# EAGLE design UknownWatch_Bottom (EAGLE 9.6.2)
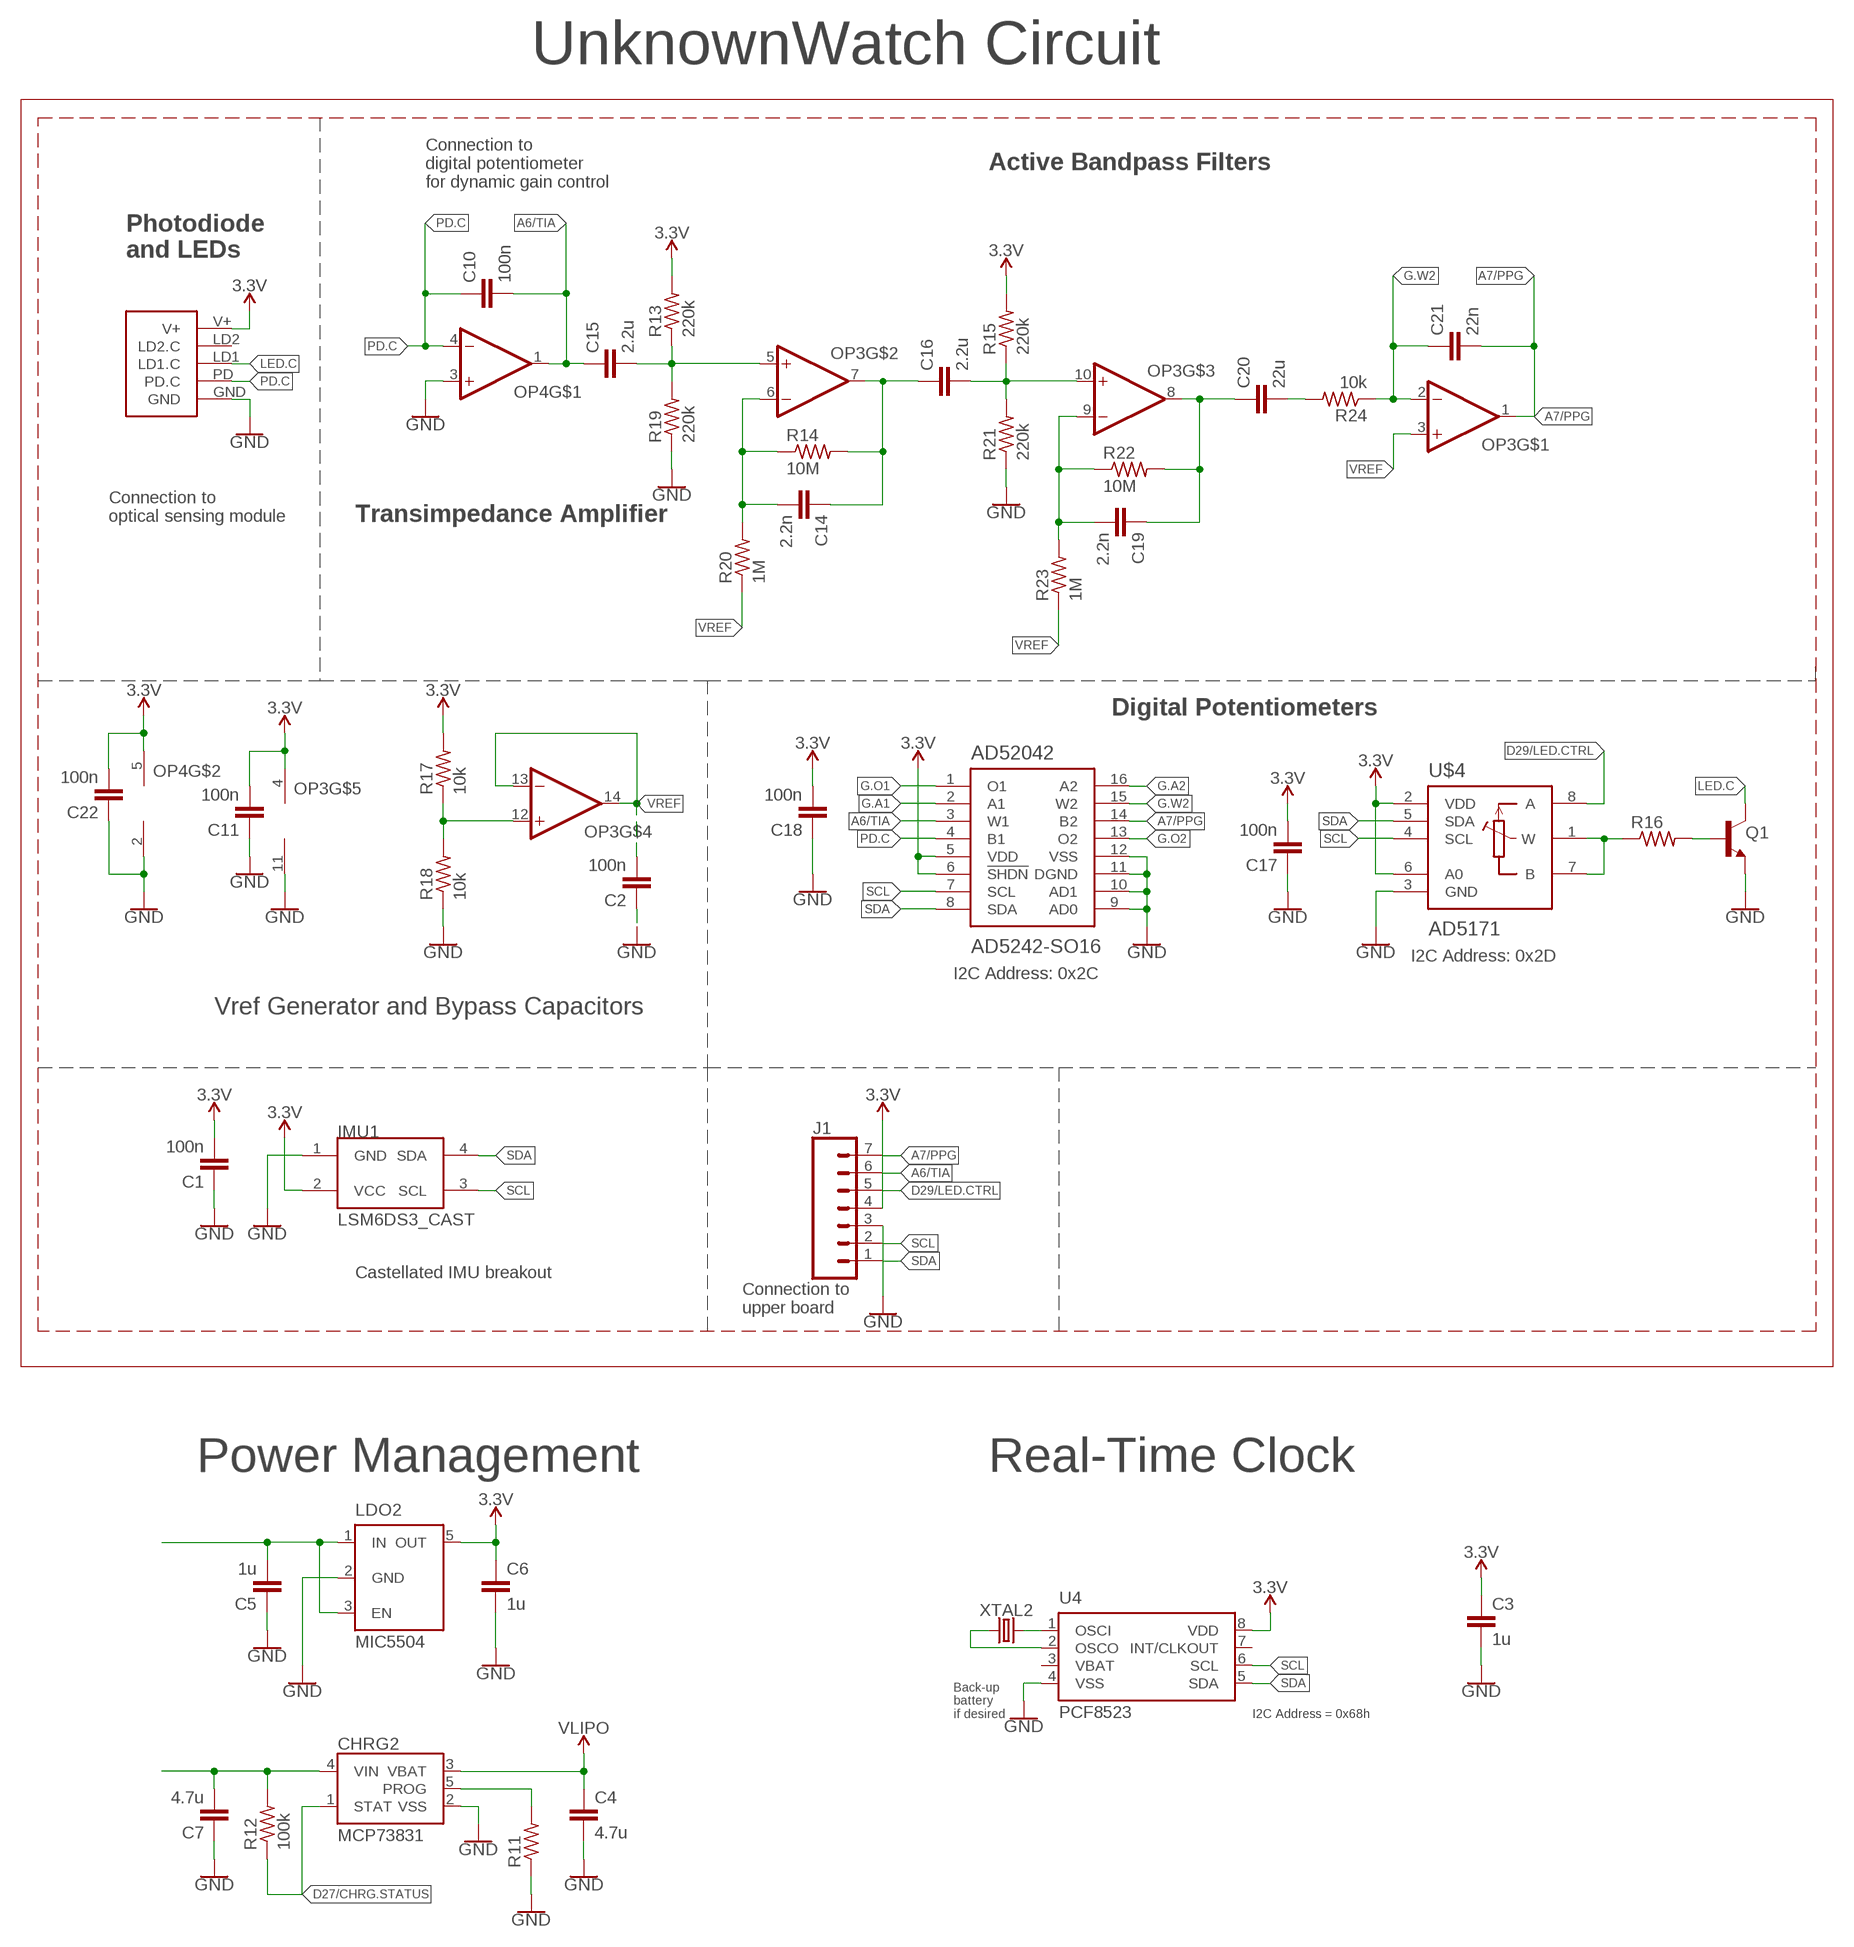
[diagram p0: schematic, sheet 1]

## Parts
AD52042  AD5242-SO16  [SO16]
C1  100n  CAPACITOR0603  [C0603]
C2  100n  CAPACITOR0603  [C0603]
C3  1u  CAPACITOR0603  [C0603]
C4  4.7u  CAPACITOR0603  [C0603]
C5  1u  CAPACITOR0603  [C0603]
C6  1u  CAPACITOR0603  [C0603]
C7  4.7u  CAPACITOR0603  [C0603]
C10  100n  CAPACITOR0603  [C0603]
C11  100n  CAPACITOR0603  [C0603]
C14  2.2n  CAPACITOR0603  [C0603]
C15  2.2u  CAPACITOR0603  [C0603]
C16  2.2u  CAPACITOR0603  [C0603]
C17  100n  CAPACITOR0603  [C0603]
C18  100n  CAPACITOR0603  [C0603]
C19  2.2n  CAPACITOR0603  [C0603]
C20  22u  CAPACITOR0603  [C0603]
C21  22n  CAPACITOR0603  [C0603]
C22  100n  CAPACITOR0603  [C0603]
CHRG2  MCP73831  [SOT23-5]
IMU1  LSM6DS3_CAST  [LSM6DS3_CAST]
J1  CONN_07-1.27MM  [1X07_1.27MM]
LDO2  MIC5504  [SOT23-5]
OP3  OP-QUAD-SO14  [SO14]
OP4  OP-SINGLEOT  [SOT23-5]
Q1  NPN-GENERIC  [SOT23-3]
R11  RESISTOR0603  [R0603]
R12  100k  RESISTOR0603  [R0603]
R13  220k  RESISTOR0603  [R0603]
R14  10M  RESISTOR0603  [R0603]
R15  220k  RESISTOR0603  [R0603]
R16  RESISTOR0603  [R0603]
R17  10k  RESISTOR0402  [R0402]
R18  10k  RESISTOR0402  [R0402]
R19  220k  RESISTOR0603  [R0603]
R20  1M  RESISTOR0603  [R0603]
R21  220k  RESISTOR0603  [R0603]
R22  10M  RESISTOR0603  [R0603]
R23  1M  RESISTOR0603  [R0603]
R24  10k  RESISTOR0603  [R0603]
U4  PCF8523  [SO8]
U$3  PPG.MODULE.2  [PPG.MODULE.2]
U$4  AD5171  [SOT-23-8]
XTAL2  32.7680kHz  CRYSTALECS-.327-12.5-12-C-TR  [2-SMD.NOLEAD.2.0MMTO1.2MM]

## Nets
3.3V: AD52042.5(VDD) AD52042.6(!SHDN) C1.2 C3.1 C6.1 C11.2 C17.2 C18.2 C22.2 IMU1.2(VCC) J1.4 LDO2.5(OUT) OP3.4(V+) OP4.5(V+) R13.2 R15.2 R17.2 U4.8(VDD) U$3.V+ U$4.2(VDD) U$4.6(A0)
A6/TIA: AD52042.3(W1) C10.2 C15.1 J1.6 OP4.1(OUT)
A7/PPG: AD52042.14(B2) C21.2 J1.7 OP3.1(OUT)
D27/CHRG.STATUS: CHRG2.1(STAT) R12.1
D29/LED.CTRL: J1.5 U$4.8(A)
G.A1: AD52042.2(A1)
G.A2: AD52042.16(A2)
G.O1: AD52042.1(O1)
G.O2: AD52042.13(O2)
G.W2: AD52042.15(W2) C21.1 OP3.2(-IN) R24.1
GND: AD52042.9(AD0) AD52042.10(AD1) AD52042.11(DGND) AD52042.12(VSS) C1.1 C2.1 C3.2 C4.2 C5.1 C6.2 C7.1 C11.1 C17.1 C18.1 C22.1 CHRG2.2(VSS) IMU1.1(GND) J1.3 LDO2.2(GND) OP3.11(V-) OP4.2(V-) OP4.3(+IN) Q1.2(E) R11.1 R18.1 R19.1 R21.1 U4.4(VSS) U$3.GND U$4.3(GND)
LED.C: Q1.3(C) U$3.LD1(LD1.C)
N$1: U4.1(OSCI) XTAL2.P$2
N$2: CHRG2.5(PROG) R11.2
N$6: U4.2(OSCO) XTAL2.P$1
N$8: Q1.1(B) R16.2
N$9: R16.1 U$4.1(W) U$4.7(B)
N$10: OP3.12(+IN) R17.1 R18.2
N$13: C15.2 OP3.5(+IN) R13.1 R19.2
N$15: C14.2 OP3.6(-IN) R14.1 R20.2
N$16: C14.1 C16.1 OP3.7(OUT) R14.2
N$17: C16.2 OP3.10(+IN) R15.1 R21.2
N$18: C19.2 OP3.9(-IN) R22.1 R23.2
N$19: C19.1 C20.1 OP3.8(OUT) R22.2
N$20: C20.2 R24.2
PD.C: AD52042.4(B1) C10.1 OP4.4(-IN) U$3.PD(PD.C)
SCL: AD52042.7(SCL) IMU1.3(SCL) J1.2 U4.6(SCL) U$4.4(SCL)
SDA: AD52042.8(SDA) IMU1.4(SDA) J1.1 U4.5(SDA) U$4.5(SDA)
VIN: C5.2 C7.2 CHRG2.4(VIN) LDO2.1(IN) LDO2.3(EN) R12.2
VLIPO: C4.1 CHRG2.3(VBAT)
VREF: C2.2 OP3.3(+IN) OP3.13(-IN) OP3.14(OUT) R20.1 R23.1
Unconnected: U4.7(INT/CLKOUT) U$3.LD2(LD2.C)

## Notes on the sheet
- UnknownWatch Circuit
- Active Bandpass Filters
- Connection to 
  digital potentiometer
  for dynamic gain control
- Photodiode
  and LEDs
- Connection to 
  optical sensing module
- Transimpedance Amplifier
- Digital Potentiometers
- I2C Address: 0x2D
- I2C Address: 0x2C
- Vref Generator and Bypass Capacitors
- Castellated IMU breakout
- Connection to 
  upper board
- Power Management | Real-Time Clock
- Back-up
  battery
  if desired
- I2C Address = 0x68h

## Power pins joined to a net without a drawn wire
VBAT: U4.3(VBAT)

## Library data of the parts
AD52042 = LinnesLab-DigitalIC:AD5242
C1-C7 C10 C11 C14-C22 = LinnesLab-Passives:CAPACITOR
CHRG2 = LinnesLab-Power:MCP73831: MCP73831T Li-Ion, Li-Pol Controller Miniature single cell, fully integrated Li-Ion, Li-polymer charge management controller Datasheet <http://ww1.microchip.com/downloads/en/DeviceDoc/20001984g.pdf> SparkFun Products: SparkFun ESP32 Thing <https://www.sparkfun.com/products/13907> SparkFun 9DoF Razor IMU M0 <https://www.sparkfun.com/products/14001>; PROD_ID: IC-09995
IMU1 = LinnesLab-Sensors:LSM6DS3_CAST
J1 = LinnesLab-Connectors:CONN_07: Multi connection point. Often used as Generic Header-pin footprint for 0.1 inch spaced/style header connections On any of the 0.1 inch spaced packages, you can populate with these: Break Away Headers - Straight <https://www.sparkfun.com/products/116> (PRT-00116) Break Away Male Headers - Right Angle <https://www.sparkfun.com/products/553> (PRT-00553) Female Headers <https://www.sparkfun.com/products/115> (PRT-00115) Break Away Headers - Machine Pin <https://www.sparkfun.com/products/117> (PRT-00117) Break Away Female Headers - Swiss Machine Pin <https://www.sparkfun.com/products/743> (PRT-00743) For SCREWTERMINALS and SPRING TERMINALS visit here: Screw Terimnals on SparkFun.com <https://www.sparkfun.com/search/results?term=Screw+Terminals> (5mm/3.5mm/2.54mm spacing) This device is also useful as a general connection point to wire up your design to another part of your project. Our various solder wires solder well into these plated through hole pads. Hook-Up Wire - Assortment (Stranded, 22 AWG) <https://www.sparkfun.com/products/11375> (PRT-11375) Hook-Up Wire - Assortment (Solid Core, 22 AWG) <https://www.sparkfun.com/products/11367> (PRT-11367) View the entire wire category on our website here <https://www.sparkfun.com/categories/141> Special notes: Molex polarized connector foot print use with SKU : PRT-08231 with associated crimp pins and housings. 1MM SMD Version SKU: PRT-10208 NOTES ON THE VARIANTS LOCK and LOCK_LONGPADS... This footprint was designed to help hold the alignment of a through-hole component (i.e. 6-pin header) while soldering it into place. You may notice that each hole has been shifted either up or down by 0.005 of an inch from it's more standard position (which is a perfectly straight line). This slight alteration caused the pins (the squares in the middle) to touch the edges of the holes. Because they are alternating, it causes a "brace" to hold the component in place. 0.005 has proven to be the perfect amount of "off-center" position when using our standard breakaway headers. Although looks a little odd when you look at the bare footprint, once you have a header in there, the alteration is very hard to notice. Also,if you push a header all the way into place, it is covered up entirely on the bottom side.
LDO2 = LinnesLab-Power:MIC5504: MIC5504 Voltage Regulator Output Voltages: 1.0V to 3.3V Input Voltages: 2.5V to 5.5V Link to Datasheet http://ww1.microchip.com/downloads/en/DeviceDoc/MIC550X.pdf
OP3 = LinnesLab-AnalogIC:OP-QUAD: General symbol and footprints for Quad Op Amps. Use with any standard general purpose op amp.
OP4 = LinnesLab-AnalogIC:OP-SINGLE: Single Op Amp 2.7V to 6.0V Single Supply CMOS Source: http://ww1.microchip.com/downloads/en/DeviceDoc/21314g.pdf
Q1 = LinnesLab-DiscreteSemi:NPN
R11-R24 = LinnesLab-Passives:RESISTOR
U4 = LinnesLab-Clocks:PCF8523; DIGIKEY: 568-5306-1-ND; I2C_ADDRESS: 0x68h; MFN: PCF8523T/1,118; MFN_MANUFACTURER: NXP USA Inc.
U$3 = LinnesLab-Connectors:PPG.MODULE.2: Digi-Key Part Number: S9014E-50-ND Manufacturer Part Number: GRPB501VWVN-RC Description: 1mm insulation height 0.05in pitch 50 positions
U$4 = LinnesLab-DigitalIC:AD5171
XTAL2 = LinnesLab-Clocks:CRYSTAL; DIGIKEY: XC2288CT-ND; FREQ: 32.7680KHZ; LOAD_CAP: 12.5pF

## Board
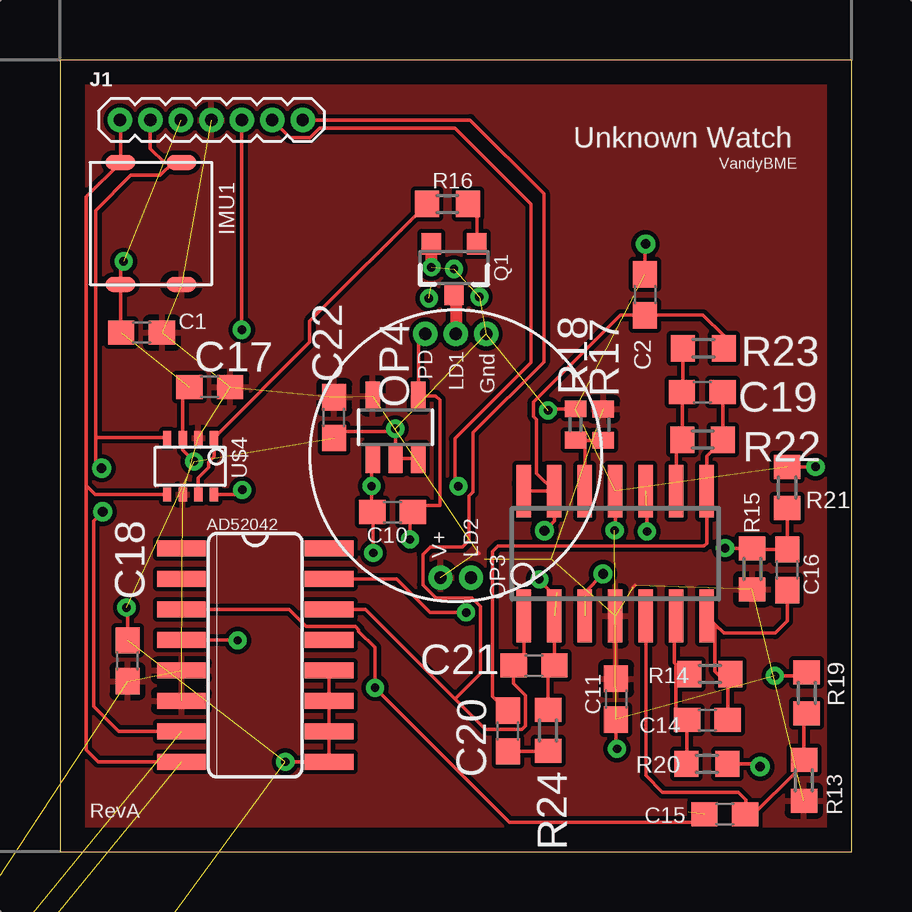
[diagram p1: board, top side]
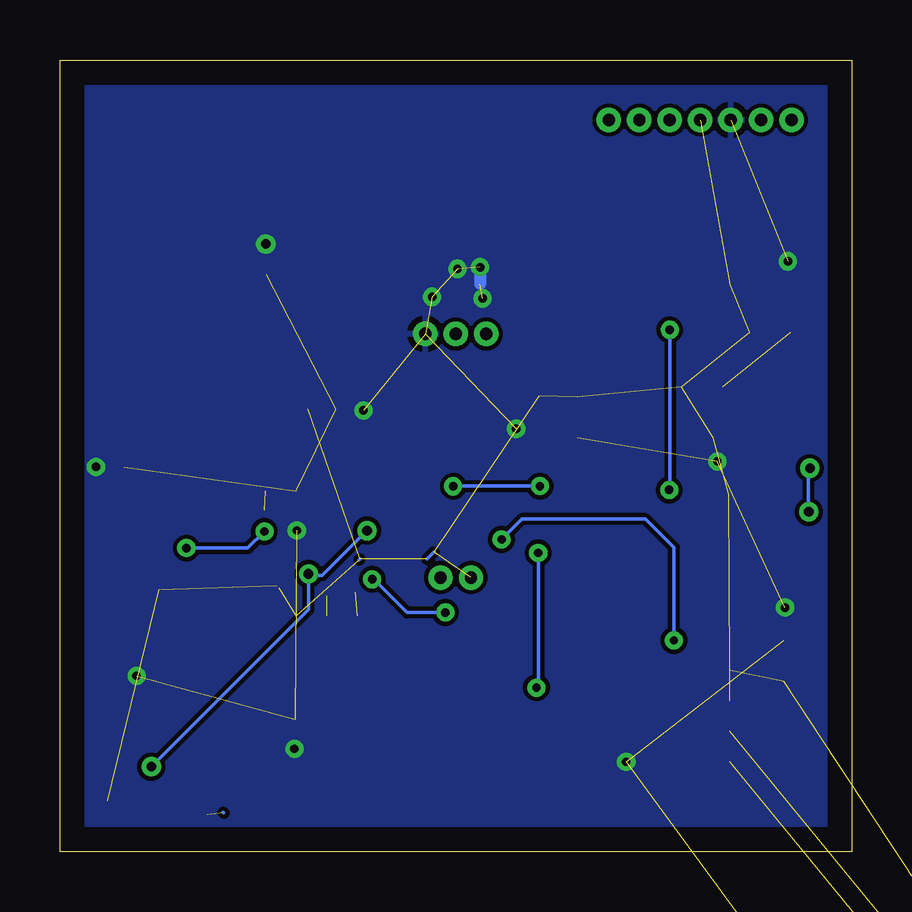
[diagram p2: board, bottom side, seen from below]

Size 33 x 33 mm. Coordinates in mm from the lower left corner, seen from the top.
Outline: 0,0 33,0 33,33 0,33 0,0
Copper layers (1*16): Top 0.035mm / dielectric 1.5mm / Bottom 0.035mm
Design rules "default": minimum track width 6mil, minimum drill 0.35mm, track to track 6mil, track to pad 6mil, pad to pad 6mil, via to via 6mil, smd to smd 6mil, copper to edge 40mil, drill to drill 6mil, minimum pad ring 10mil, minimum via ring 8mil, stop-mask expansion 4mil, vias tented up to drill 0mil, thermal gap 10mil

### Footprints (pad centres in the part's own frame; a part is rotated, then mirrored left to right if it is on the bottom)
SO16 = smd 0.66 x 2.032: 1 -4.445,-3.073; 2 -3.175,-3.073; 3 -1.905,-3.073; 4 -0.635,-3.073; 5 0.635,-3.073; 6 1.905,-3.073; 7 3.175,-3.073; 8 4.445,-3.073; 9 4.445,3.073; 10 3.175,3.073; 11 1.905,3.073; 12 0.635,3.073; 13 -0.635,3.073; 14 -1.905,3.073; 15 -3.175,3.073; 16 -4.445,3.073
C0603 = smd 1.1 x 1: 1 -0.85,0; 2 0.85,0
SOT23-5 = smd 0.55 x 1.2: 1 -0.95,-1.3; 2 0,-1.3; 3 0.95,-1.3; 4 0.95,1.3; 5 -0.95,1.3
LSM6DS3_CAST = smd 0.635 x 1.27: 1 -2.54,1.27; 2 -2.54,-1.27; 3 2.54,-1.27; 4 2.54,1.27
1X07_1.27MM = drill 0.508 pad 1: 1 0,0; 2 1.27,0; 3 2.54,0; 4 3.81,0; 5 5.08,0; 6 6.35,0; 7 7.62,0
SO14 = smd 0.6 x 2.2: 1 -3.81,-2.6; 2 -2.54,-2.6; 3 -1.27,-2.6; 4 0,-2.6; 5 1.27,-2.6; 6 2.54,-2.6; 7 3.81,-2.6; 8 3.81,2.6; 9 2.54,2.6; 10 1.27,2.6; 11 0,2.6; 12 -1.27,2.6; 13 -2.54,2.6; 14 -3.81,2.6
SOT23-5' = smd 0.6 x 1.2: 1 -0.95,-1.306; 2 0,-1.306; 3 0.95,-1.306; 4 0.95,1.306; 5 -0.95,1.306
SOT23-3 = smd 0.8 x 0.9: 1 -0.95,-1; 2 0.95,-1; 3 0,1.1
R0603 = smd 1 x 1.1: 1 -0.85,0; 2 0.85,0
R0402 = smd 0.7 x 0.9: 1 -0.65,0; 2 0.65,0
SO8 = smd 1.3 x 0.6: 1 -2.65,1.905; 2 -2.65,0.635; 3 -2.65,-0.635; 4 -2.65,-1.905; 5 2.65,-1.905; 6 2.65,-0.635; 7 2.65,0.635; 8 2.65,1.905
PPG.MODULE.2 = drill 0.508 pad 0.94: GND 1.27,5.08; LD1 0,5.08; LD2 0.635,-5.08; PD -1.27,5.08; V+ -0.635,-5.08
SOT-23-8 = smd 0.35 x 0.6: 1 -0.991,-1.176; 2 -0.341,-1.176; 3 0.309,-1.176; 4 0.959,-1.176; 5 0.959,1.176; 6 0.309,1.176; 7 -0.341,1.176; 8 -0.991,1.176
2-SMD.NOLEAD.2.0MMTO1.2MM = smd 0.7 x 1.3: P$1 -0.8,0; P$2 0.8,0

### Placement (x,y rotation side)
AD52042  8.14,8.19 270 top
C1  3.4,21.63 0 top
C2  24.38,23.21 270 top
C3  -3.17,-12.24 0 top  (outside the outline)
C4  -2.83,-21.1 0 top  (outside the outline)
C5  -6.36,-25.17 0 top  (outside the outline)
C6  -3.35,-25.17 0 top  (outside the outline)
C7  -9.44,-25.17 0 top  (outside the outline)
C10  13.87,14.15 180 top
C11  23.19,6.36 90 top
C14  26.99,5.49 180 top
C15  27.71,1.55 0 top
C16  30.32,11.74 90 top
C17  6.24,19.36 0 top
C18  2.81,7.95 270 top
C19  26.78,19.15 180 top
C20  18.67,5.03 270 top
C21  19.76,7.76 180 top
C22  11.43,18.09 90 top
CHRG2  -8.13,-17.05 0 top  (outside the outline)
IMU1  3.79,26.18 90 top
J1  2.5,30.5 0 top
LDO2  -8.13,-29.59 0 top  (outside the outline)
OP3  23.15,12.42 0 top
OP4  [SOT23-5']  13.99,17.69 0 top
Q1  16.43,24.34 180 top
R11  -3.59,-29.25 0 top  (outside the outline)
R12  -6.14,-21.1 0 top  (outside the outline)
R13  31.01,2.97 270 top
R14  27.1,7.4 0 top
R15  28.86,11.78 270 top
R16  16.15,27 0 top
R17  22.65,17.79 90 top
R18  21.49,17.8 270 top
R19  31.13,6.62 270 top
R20  26.97,3.66 180 top
R21  30.31,15.18 270 top
R22  26.79,17.17 0 top
R23  26.82,20.98 180 top
R24  20.35,5.05 270 top
U4  -7.54,-6.51 0 top  (outside the outline)
U$1  [REV.A]  1.24,1.4 0 top
U$3  16.5,16.5 0 top
U$4  5.43,16.06 180 top
XTAL2  -8.6,-12.45 0 top  (outside the outline)

### Tracks (layer width: path | path; a pad name or v marks a point on that pad's centre or on a via)
3.3V  (23 unrouted)
  Top 0.152: C11.2 23.15,7.24 OP3.4 | 17.47,12.42 17.41,12.48 | 23.96,11.09 23.89,11.02
  Bottom 0.152: 17.41,12.48 17.69,12.2 | 20.49,12.2 20.53,12.16
  pour Top (isolate 0.178): 0.93,32.32 32.3,32.32 32.3,0.57 0.93,0.57
A6/TIA  (via drill 0.35)  (1 unrouted)
  Top 0.152: OP4.1 12.99,16.33 v12.99,15.23 12.99,14.18 C10.2 13.06,14.11 v13.06,12.45 | C15.1 26.54,1.23 18.74,1.23 v13.14,6.83 13.14,8.5 12.46,9.18 12.46,9.25 12.32,9.38 10.26,9.38 9.54,10.09 AD52042.3 | 16.67,15.23 v16.61,15.23 16.46,15.38 16.46,17.22 19.64,20.39 19.64,26.99 16.47,30.15 10.81,30.15 10.43,29.76 9.59,29.76 J1.6
  Bottom 0.152: 26.17,1.61 26.2,1.63 | v13.06,12.45 13.06,6.91 v13.14,6.83 | v16.61,15.23 13.06,15.23 12.99,15.3 v12.99,15.23
A7/PPG
  Top 0.152: OP3.1 19.34,8.19 C21.2 18.91,7.01 19.4,6.52 19.4,5.23 19.26,5.1 17.74,5.1 16.48,6.36 | 16.48,6.36 12.74,10.09 AD52042.14 | 16.48,6.36 17.54,7.42 17.54,10.22 17.18,10.57 15.67,10.57 15.13,11.12 15.13,12.38 15.45,12.7 16.79,12.7 17.05,12.97 17.05,14.82 17.21,14.98 17.21,17.46 20.17,20.41 20.17,27.43 17.1,30.5 J1.7
D27/CHRG.STATUS  (1 unrouted)
D29/LED.CTRL  (via drill 0.35)
  Top 0.152: v7.6,15.08 7.41,14.88 U$4.8 | J1.5 v7.58,21.75
  Bottom 0.152: v7.58,21.75 7.58,15.1 v7.6,15.08
G.W2  (via drill 0.35)  (1 unrouted)
  Top 0.152: OP3.2 C21.1 20.35,7.5 R24.1 | AD52042.15 14.04,11.36 15.43,9.97 v16.93,9.97 | v19.98,11.35 19.98,11.3 20.49,10.79 20.7,10.79
  Bottom 0.152: v16.93,9.97 18.52,9.97 19.9,11.35 v19.98,11.35
GND  (via drill 0.35, 0.4)  (25 unrouted)
  Top 0.152: R18.1 20.41,18.45 v20.35,18.39 | OP3.11 23.15,13.41 v23.12,13.38 | R21.1 v31.5,16.03 | C11.1 23.19,4.32 v23.22,4.28 | v2.77,10.17 2.81,10.13 C18.1 | 13.99,17.5 OP4.2 OP4.3 | 13.99,17.5 v13.99,17.61 v13.98,17.62 | C22.1 11.69,17.5 13.99,17.5 | AD52042.12 AD52042.11 AD52042.10 AD52042.9 v9.4,3.74 v9.39,3.74 | v2.65,24.6 2.52,24.48 IMU1.1 2.53,21.66 C1.1 | C17.1 5.12,19.09 U$4.3 5.12,16.74 v5.59,16.26 | R19.1 30.99,7.32 v29.81,7.32 | C2.1 24.38,25.29 v24.41,25.33
  Top 0.508: Q1.2 v15.48,24.37 v15.48,24.36
  Bottom 0.508: v15.48,24.36 15.48,23.67
  other vias: 17.48,23.12 15.38,23.07 16.43,24.29
  pour Bottom (isolate 0.178): 0.57,32.62 32.66,32.62 32.66,0.45 0.59,0.45 0.59,32.61 0.62,32.61
LED.C
  Top 0.508: Q1.3 16.5,23.17 U$3.LD1
N$1  (1 unrouted)
N$2  (1 unrouted)
N$6  (1 unrouted)
N$8
  Top 0.152: R16.2 17.38,26.62 Q1.1
N$9
  Top 0.152: R16.1 10.41,22.11 10.41,21.23 U$4.1 6.42,16.46 6.2,16.24 6.2,16.01 5.77,15.58 U$4.7
N$10
  Top 0.152: R17.1 21.55,17.14 | 21.55,17.14 21.5,17.14 R18.2 | OP3.12 21.88,16.81 21.55,17.14
N$13
  Top 0.152: R19.2 31.01,5.65 R13.1 31.01,3.64 28.6,1.23 28.6,1.58 | 28.6,1.58 C15.2 | OP3.5 24.42,3.17 25.12,2.46 28.28,2.46 28.6,2.15 28.6,1.58
N$15
  Top 0.152: R14.1 25.68,6.83 | 25.68,6.83 25.68,5.63 25.82,5.49 C14.2 26.14,3.68 R20.2 | OP3.6 25.61,9.74 25.61,7.86 25.68,7.79 25.68,6.83
N$16
  Top 0.152: R14.2 27.84,7.29 C14.1 27.84,6.98 27.31,7.51 27.31,9.47 | 27.31,9.47 27,9.78 OP3.7 | C16.1 30.32,9.61 29.82,9.11 27.67,9.11 27.31,9.47
N$17  (via drill 0.35)  (1 unrouted)
  Top 0.152: R21.2 C16.2 28.9,12.59 R15.1 27.75,12.63 v27.73,12.65 | v24.48,13.34 24.48,14.24
  Bottom 0.152: v27.73,12.65 25.17,12.65 v24.48,13.34
N$18
  Top 0.152: OP3.9 25.69,16.91 R22.1 25.94,19.13 C19.2 25.97,19.19 R23.2
N$19
  Top 0.152: C19.1 27.64,19.13 R22.2 26.96,16.48 OP3.8 26.96,12.85 26.84,12.74 18.26,12.74 18.04,12.52 18.04,6.48 18.64,5.88 C20.1
N$20
  Top 0.152: C20.2 20.33,4.18 R24.2
PD.C  (via drill 0.35)
  Top 0.152: U$3.PD 14.94,21.29 OP4.4 15.66,18.99 15.83,18.82 15.83,14.42 14.99,14.42 C10.1 14.59,14.03 v14.59,13.01 | AD52042.4 7.39,8.82 v7.41,8.8
  Bottom 0.152: v7.41,8.8 7.41,12.67 8.6,13.86 13.74,13.86 v14.59,13.01
SCL  (via drill 0.4)  (1 unrouted)
  Top 0.152: J1.2 3.77,29.31 4.36,28.72 IMU1.3 4.71,28.72 4.17,28.19 2.96,28.19 1.49,26.73 1.49,17.2 | AD52042.7 2.45,5.01 1.41,6.05 1.41,13.79 v1.78,14.16 | U$4.4 4.45,17.25 1.55,17.25 1.49,17.2 | v1.74,15.98 1.49,16.22 1.49,17.2
  Bottom 0.152: v1.78,14.16 1.79,14.18 1.79,15.85 1.82,15.87 1.82,15.9 v1.74,15.98
SDA  (1 unrouted)
  Top 0.152: J1.1 2.52,30.48 IMU1.4 1.09,27.29 1.09,15.26 | AD52042.8 1.59,3.74 1.09,4.24 1.09,15.26 | U$4.5 1.47,14.88 1.09,15.26
VIN  (5 unrouted)
VLIPO  (1 unrouted)
VREF  (via drill 0.4)  (1 unrouted)
  Top 0.152: OP3.14 OP3.13 | OP3.13 19.87,15.76 19.87,18.01 19.74,18.14 19.74,18.75 23.36,22.36 C2.2 26.81,22.36 27.67,21.5 R23.1 | R20.1 29.07,3.66 v29.19,3.54 | v22.64,11.57 21.88,10.81 21.88,10.65 | OP3.13 20.61,13.79 v20.2,13.38 | 19.26,15.1 OP3.14 | OP3.14 19.09,15.27 19.09,15.43
  Bottom 0.152: v29.19,3.54 22.64,10.09 22.64,11.51 | 22.64,11.51 v22.64,11.57 | v20.2,13.38 22.06,11.51 22.64,11.51

### Text on the board
tNames: Unknown Watch | VandyBME